# EasyEDA Pro project ax08.eprj, schematic ax08 main, sheets 5 to 13 of 16

## Sheets
5 memory interface: Page Name: memory interface
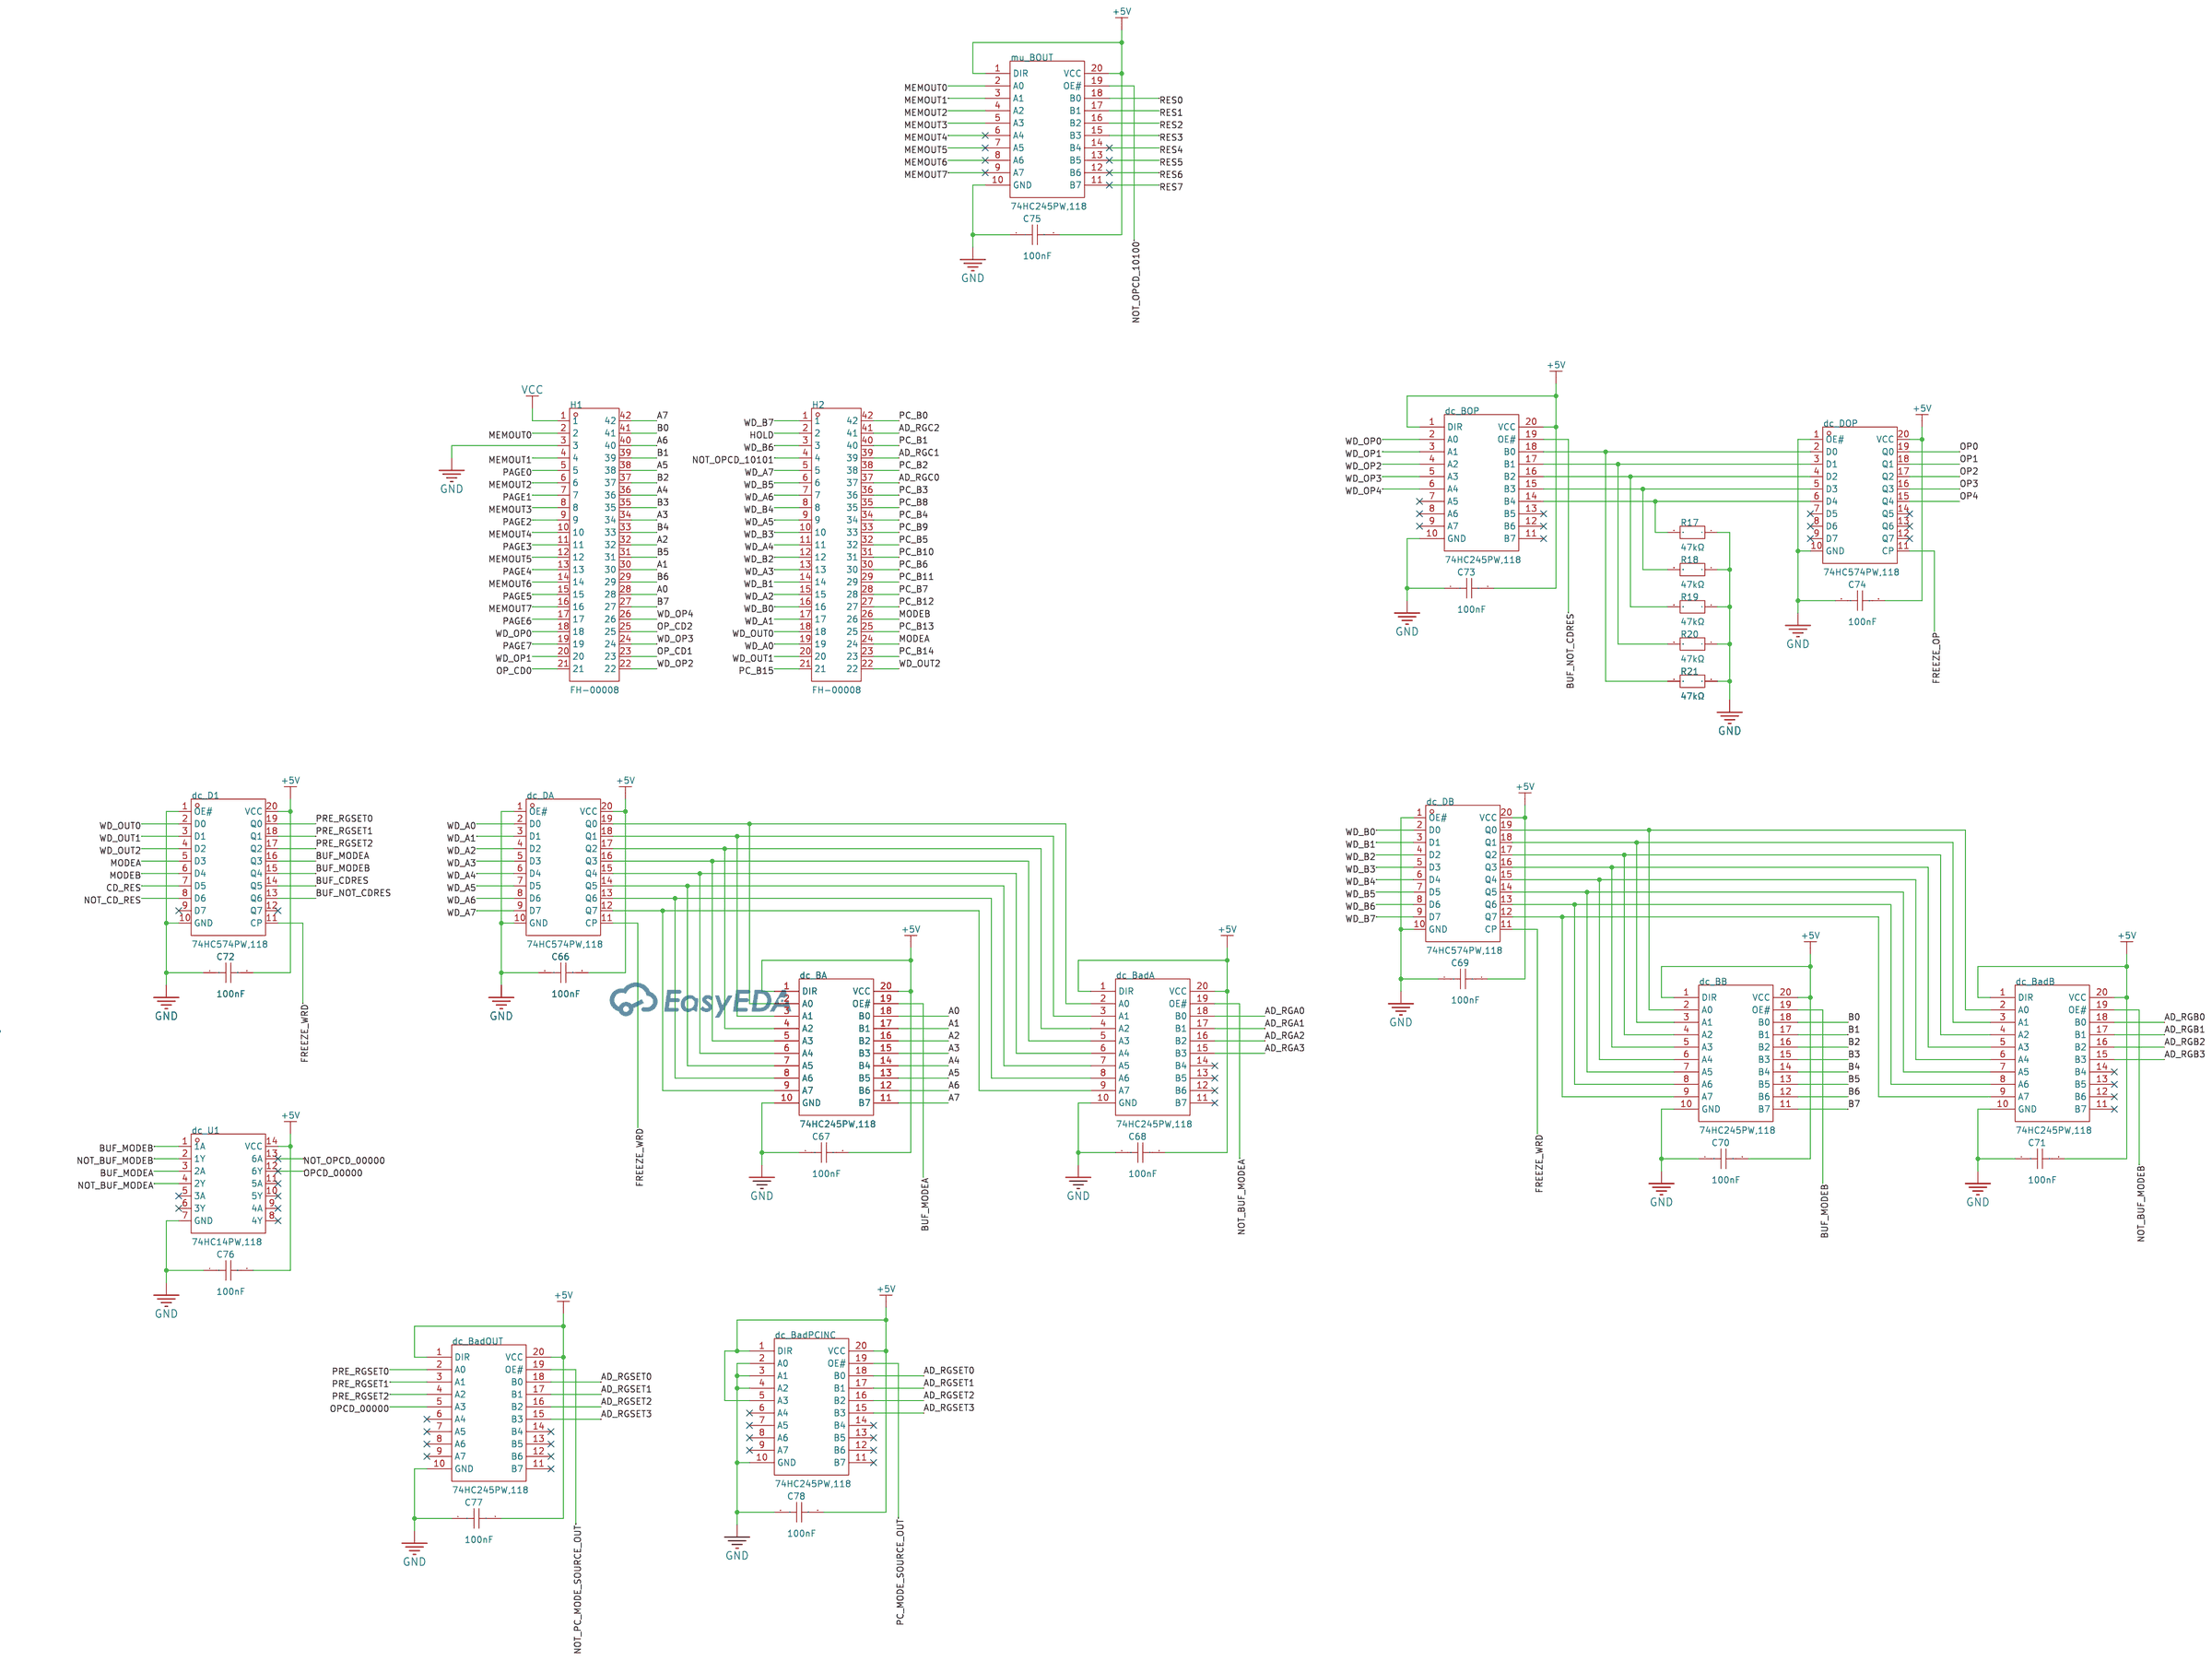
[diagram p26: memory interface]
6 hold unit: Board Name: ax08 1.0; Create Date: 2025-07-11; Page Name: hold unit; Schematic Name: ax08 1.0; Update Date: 2025-07-11
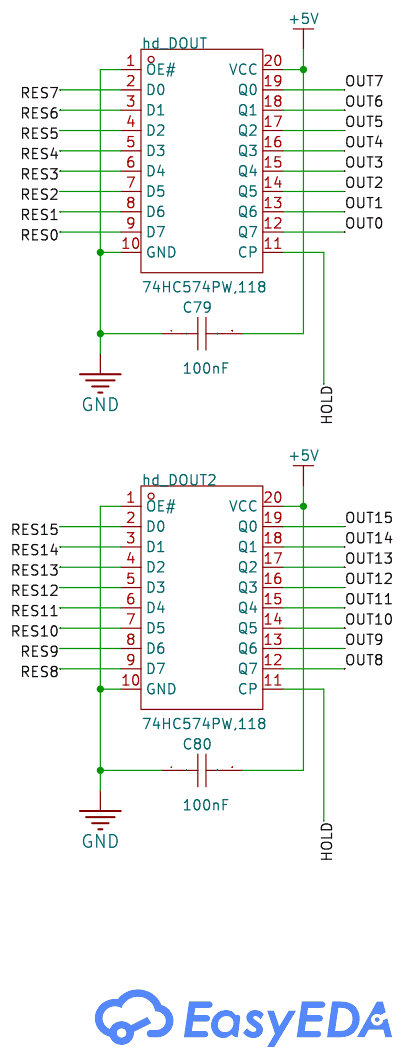
[diagram p27: hold unit]
7 frontpanel: Board Name: ax08 1.0; Create Date: 2025-07-11; Page Name: frontpanel; Schematic Name: ax08 1.0; Update Date: 2025-07-11
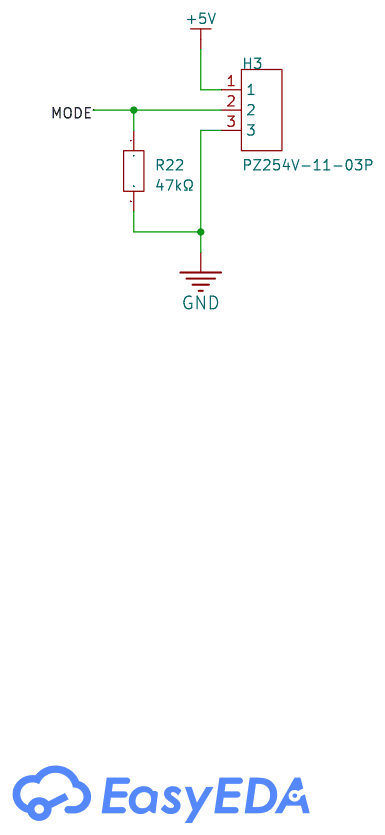
[diagram p28: frontpanel]
8 sequencer: Board Name: ax08 lite; Create Date: 2025-07-11; Page Name: sequencer; Schematic Name: ax08 lite; Update Date: 2025-07-11
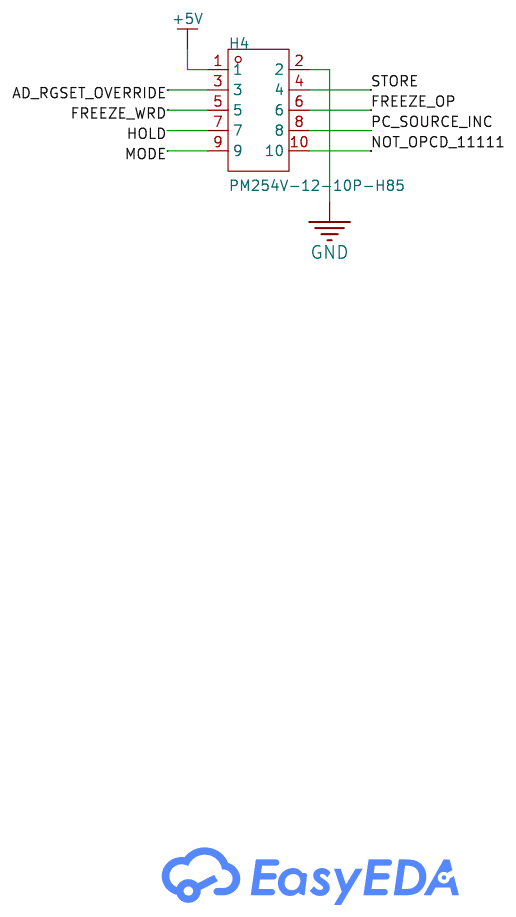
[diagram p29: sequencer]
9 opcode decoder: Page Name: opcode decoder; Update Date: 2025-09-12
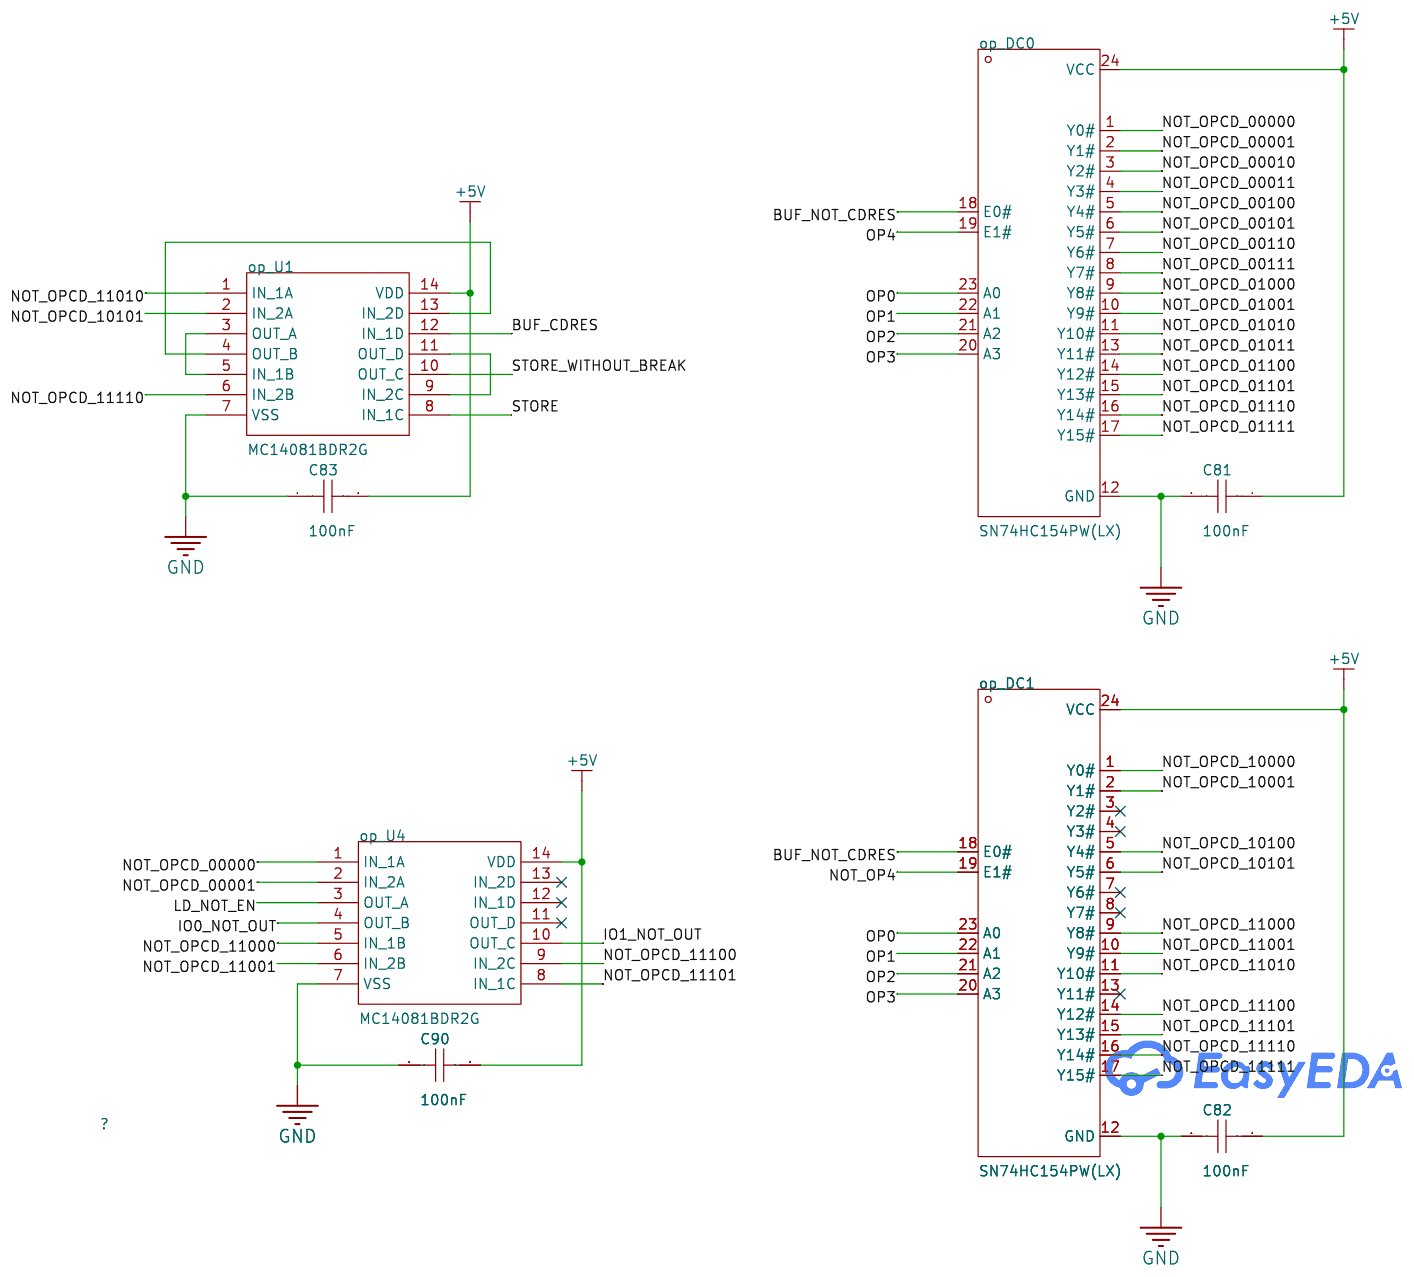
[diagram p30: opcode decoder]
10 IO units: Board Name: ax08 lite; Create Date: 2025-07-17; Page Name: IO units; Schematic Name: ax08 lite; Update Date: 2025-08-05
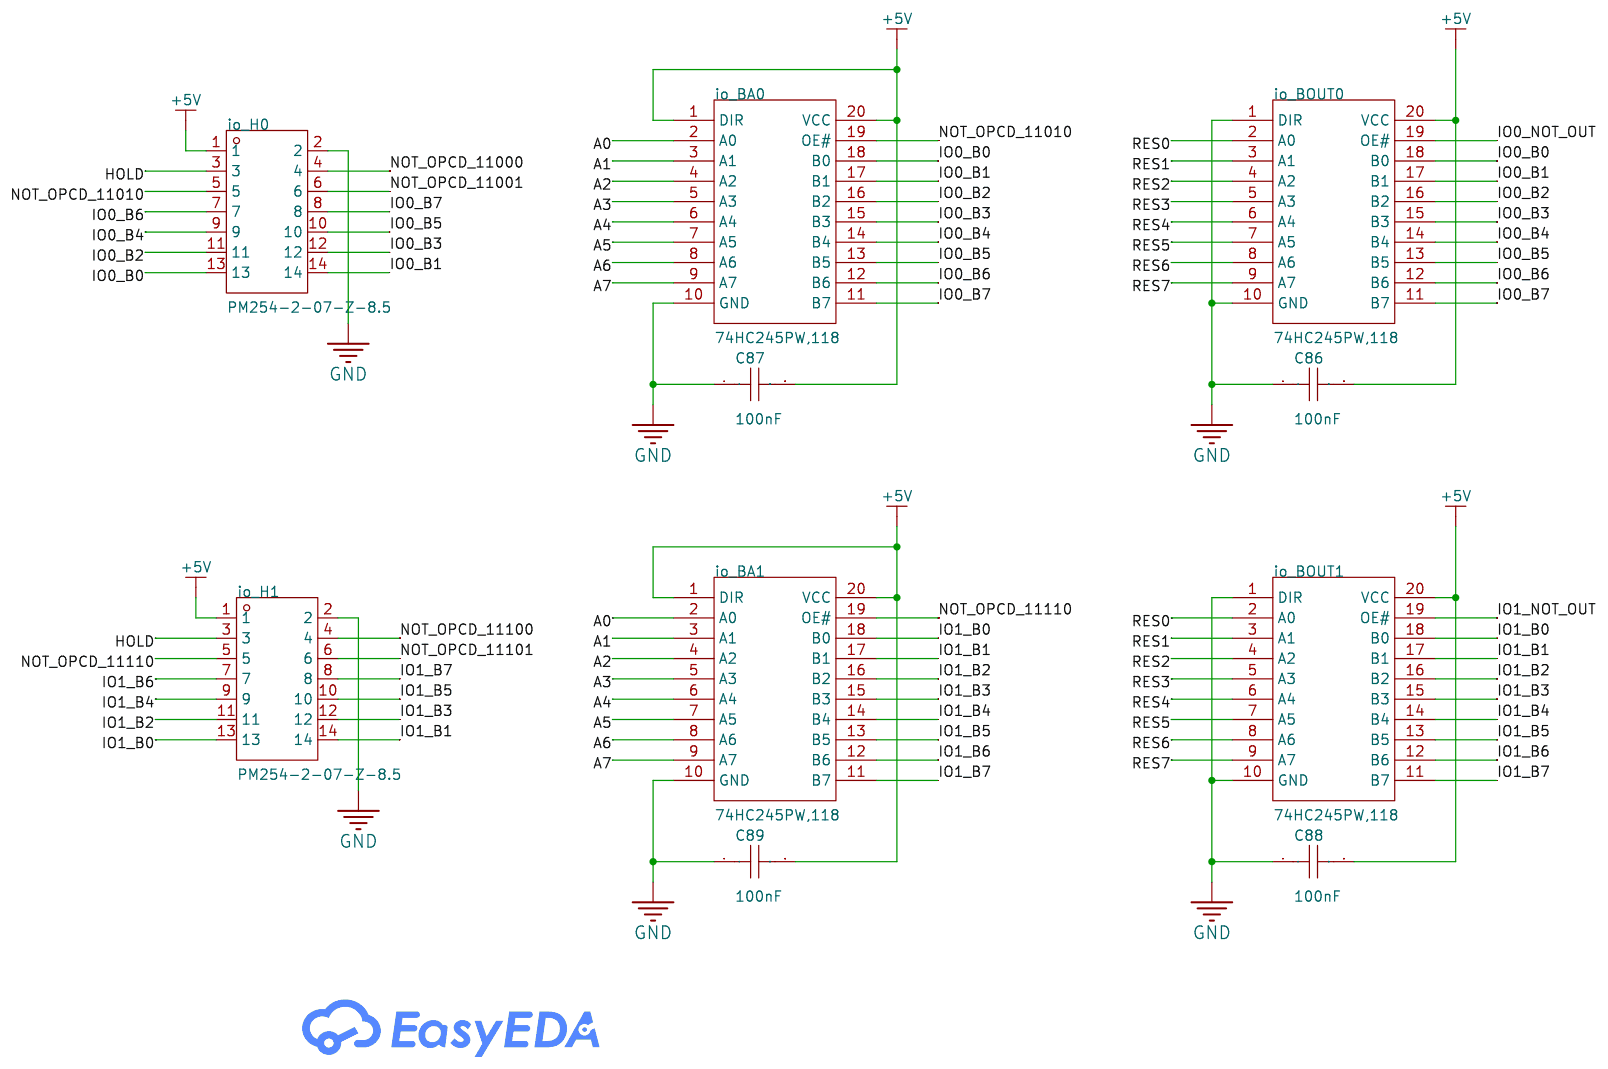
[diagram p31: IO units]
11 load unit: Board Name: ax08 lite; Create Date: 2025-07-18; Page Name: load unit; Schematic Name: ax08 lite; Update Date: 2025-07-18
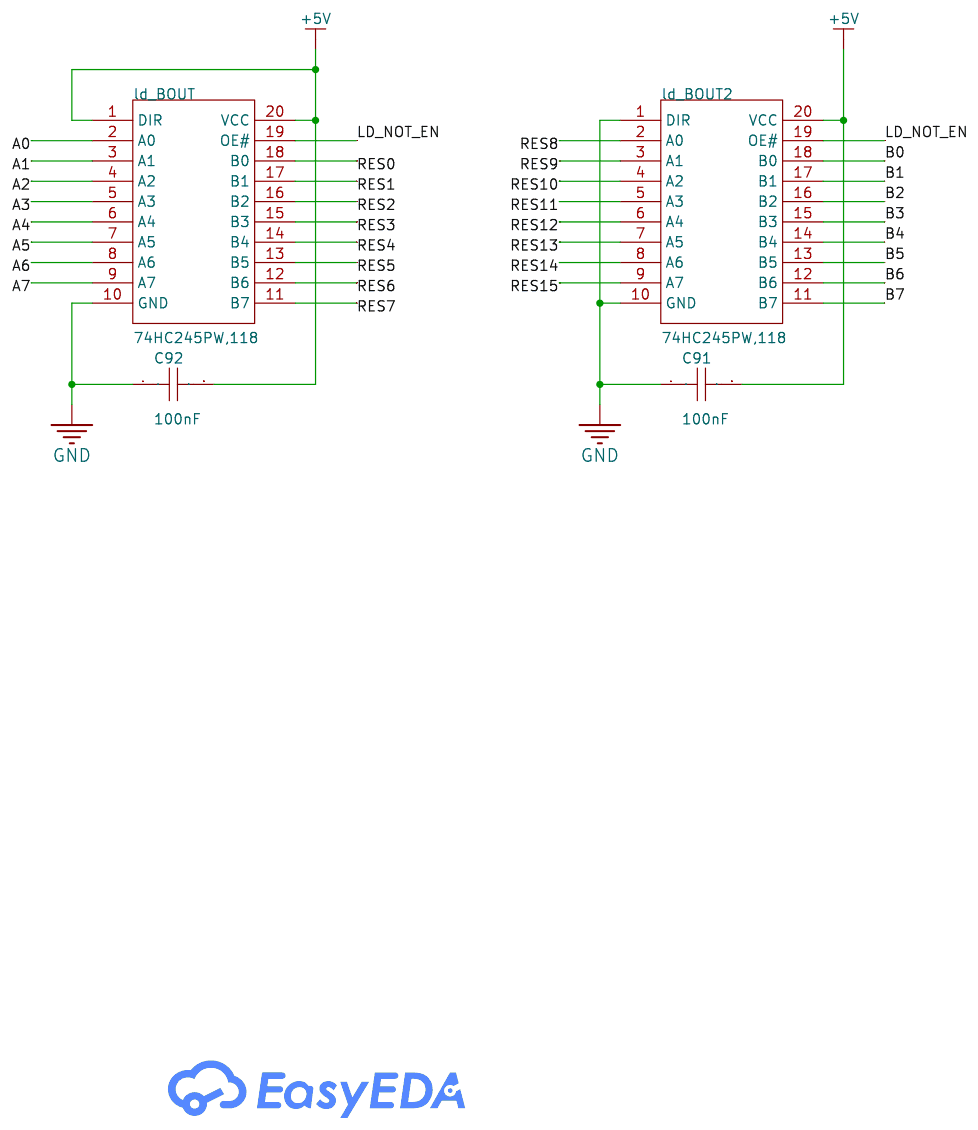
[diagram p32: load unit]
12 bitwise unit: Page Name: bitwise unit; Update Date: 2025-09-17
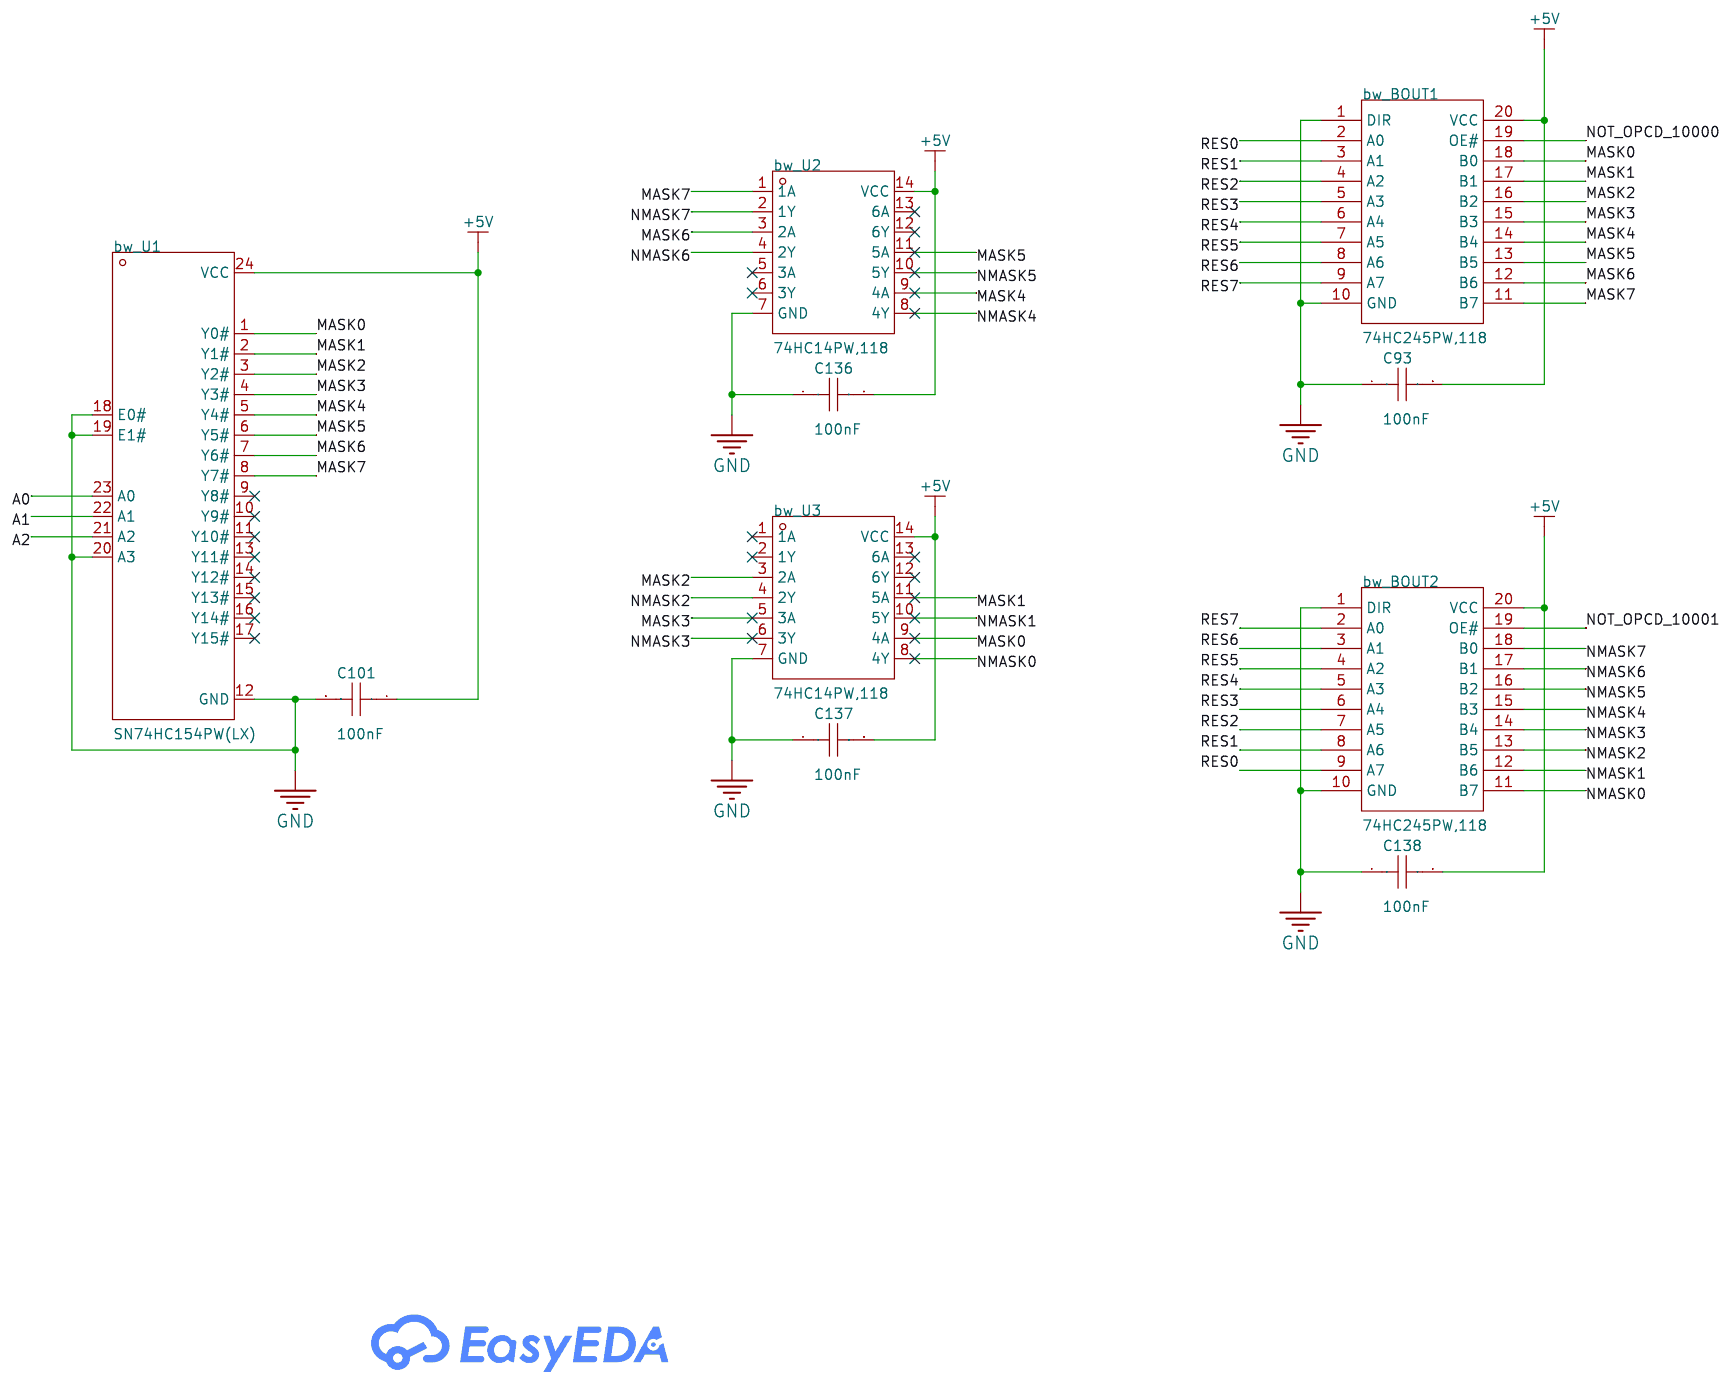
[diagram p33: bitwise unit]
13 logic unit: Page Name: logic unit; Update Date: 2025-09-15
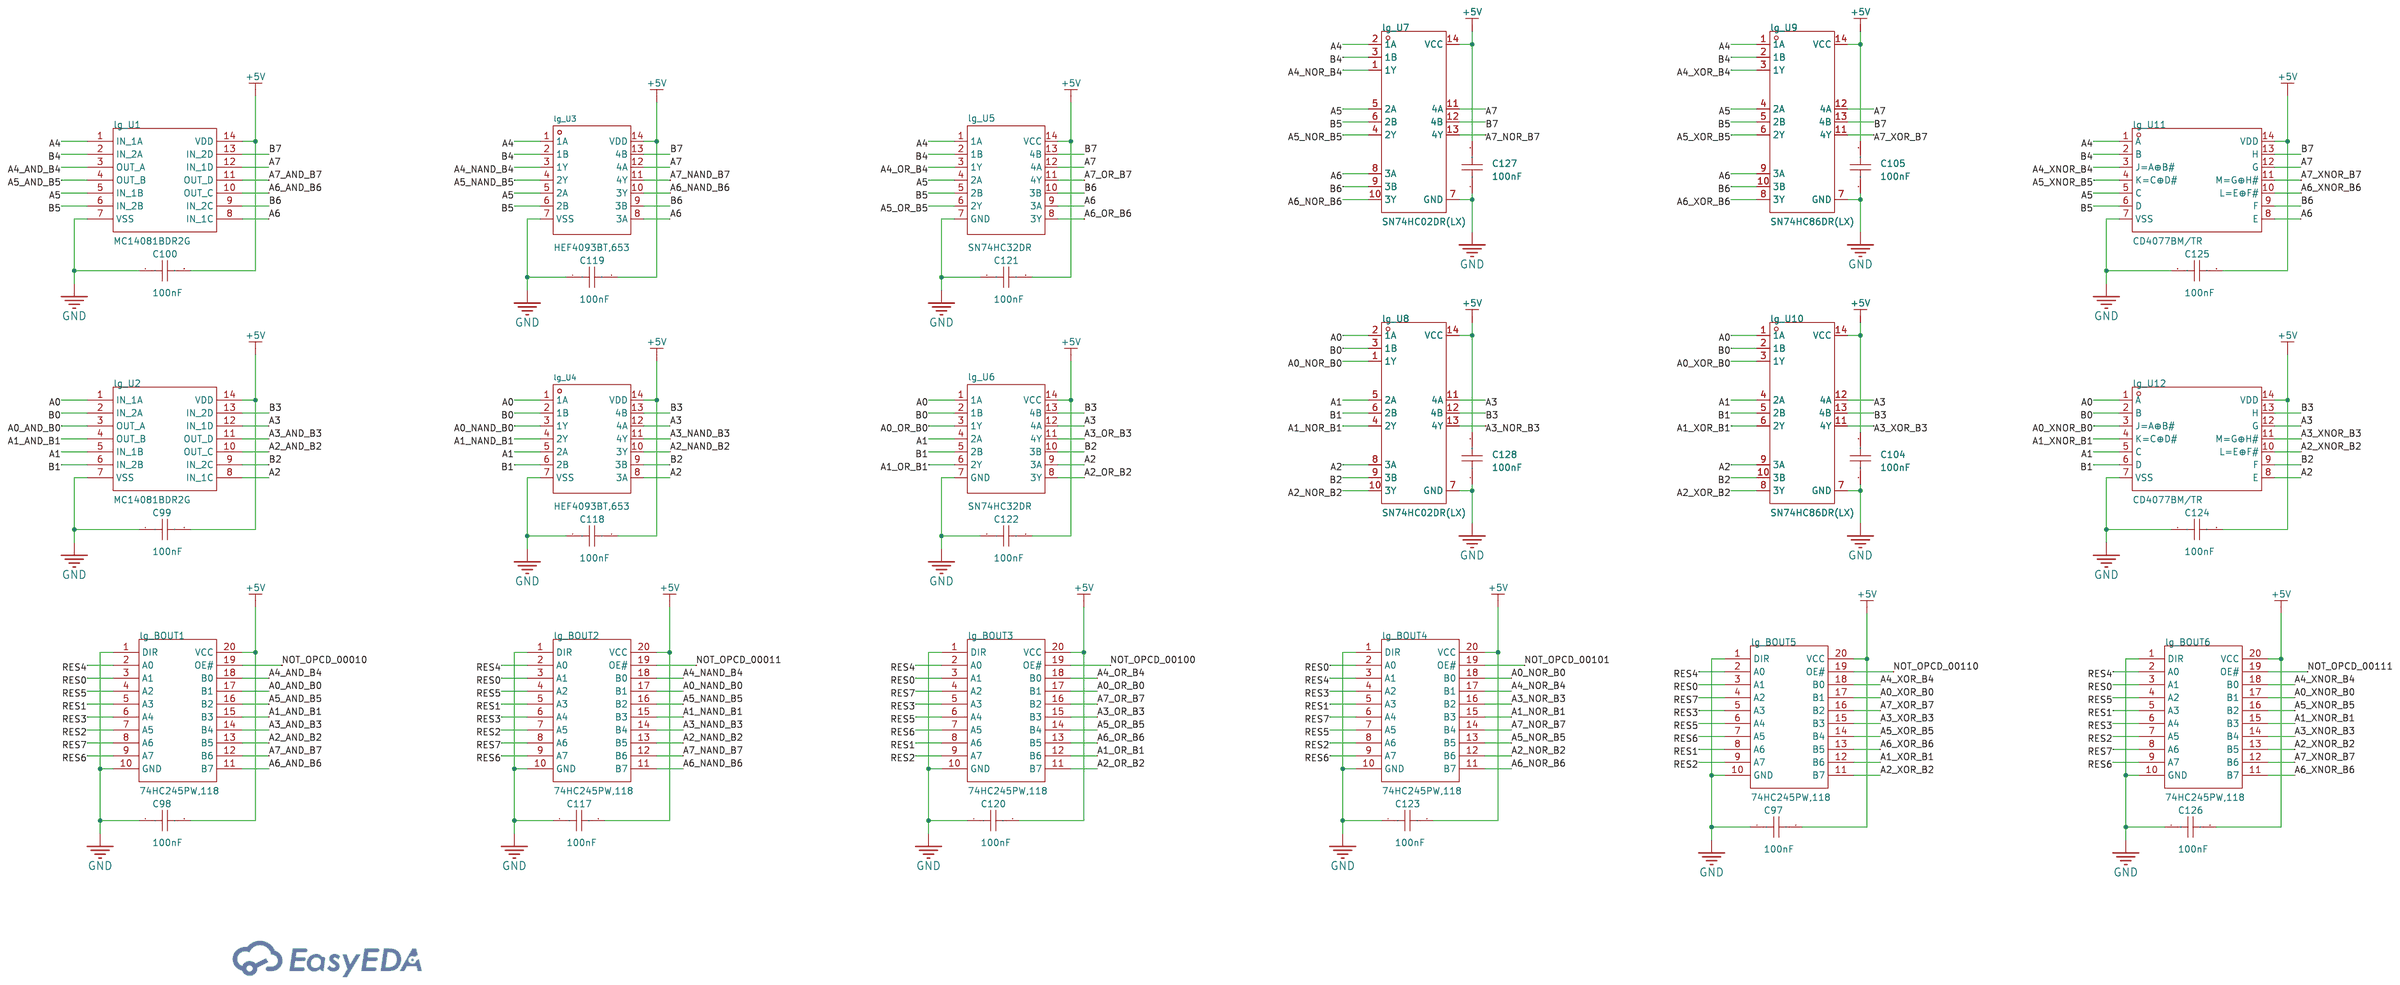
[diagram p34: logic unit]

## Parts
sheet bitwise unit
bw_BOUT1  74HC245PW,118  [TSSOP-20_L6.5-W4.4-P0.65-LS6.4-BL]
bw_BOUT2  74HC245PW,118  [TSSOP-20_L6.5-W4.4-P0.65-LS6.4-BL]
bw_U1  SN74HC154PW(LX)  [TSSOP-24_L7.8-W4.4-P0.65-LS6.4-BL_1]
bw_U2  74HC14PW,118  [TSSOP-14_L5.0-W4.4-P0.65-LS6.4-BL]
bw_U3  74HC14PW,118  [TSSOP-14_L5.0-W4.4-P0.65-LS6.4-BL]
C93  100nF  [C0805]
C101  100nF  [C0805]
C136  100nF  [C0805]
C137  100nF  [C0805]
C138  100nF  [C0805]
sheet frontpanel
H3  PZ254V-11-03P  [HDR-TH_3P-P2.54-V-M]
R22  47kΩ  [R0603]
sheet hold unit
C79  100nF  [C0805]
C80  100nF  [C0805]
hd_DOUT  74HC574PW,118  [TSSOP-20_L6.5-W4.4-P0.65-LS6.4-BL]
hd_DOUT2  74HC574PW,118  [TSSOP-20_L6.5-W4.4-P0.65-LS6.4-BL]
sheet IO units
C86  100nF  [C0805]
C87  100nF  [C0805]
C88  100nF  [C0805]
C89  100nF  [C0805]
io_BA0  74HC245PW,118  [TSSOP-20_L6.5-W4.4-P0.65-LS6.4-BL]
io_BA1  74HC245PW,118  [TSSOP-20_L6.5-W4.4-P0.65-LS6.4-BL]
io_BOUT0  74HC245PW,118  [TSSOP-20_L6.5-W4.4-P0.65-LS6.4-BL]
io_BOUT1  74HC245PW,118  [TSSOP-20_L6.5-W4.4-P0.65-LS6.4-BL]
io_H0  PM254-2-07-Z-8.5  [HDR-TH_14P-P2.54-V-F-R2-C7-S2.54]
io_H1  PM254-2-07-Z-8.5  [HDR-TH_14P-P2.54-V-F-R2-C7-S2.54]
sheet load unit
C91  100nF  [C0805]
C92  100nF  [C0805]
ld_BOUT  74HC245PW,118  [TSSOP-20_L6.5-W4.4-P0.65-LS6.4-BL]
ld_BOUT2  74HC245PW,118  [TSSOP-20_L6.5-W4.4-P0.65-LS6.4-BL]
sheet logic unit
C97  100nF  [C0805]
C98  100nF  [C0805]
C99  100nF  [C0805]
C100  100nF  [C0805]
C104  100nF  [C0805]
C105  100nF  [C0805]
C117  100nF  [C0805]
C118  100nF  [C0805]
C119  100nF  [C0805]
C120  100nF  [C0805]
C121  100nF  [C0805]
C122  100nF  [C0805]
C123  100nF  [C0805]
C124  100nF  [C0805]
C125  100nF  [C0805]
C126  100nF  [C0805]
C127  100nF  [C0805]
C128  100nF  [C0805]
lg_BOUT1  74HC245PW,118  [TSSOP-20_L6.5-W4.4-P0.65-LS6.4-BL]
lg_BOUT2  74HC245PW,118  [TSSOP-20_L6.5-W4.4-P0.65-LS6.4-BL]
lg_BOUT3  74HC245PW,118  [TSSOP-20_L6.5-W4.4-P0.65-LS6.4-BL]
lg_BOUT4  74HC245PW,118  [TSSOP-20_L6.5-W4.4-P0.65-LS6.4-BL]
lg_BOUT5  74HC245PW,118  [TSSOP-20_L6.5-W4.4-P0.65-LS6.4-BL]
lg_BOUT6  74HC245PW,118  [TSSOP-20_L6.5-W4.4-P0.65-LS6.4-BL]
lg_U1  MC14081BDR2G  [SOIC-14_L8.7-W3.9-P1.27-LS6.0-BL]
lg_U2  MC14081BDR2G  [SOIC-14_L8.7-W3.9-P1.27-LS6.0-BL]
lg_U3  HEF4093BT,653  [SOIC-14_L8.7-W3.9-P1.27-LS6.0-BL]
lg_U4  HEF4093BT,653  [SOIC-14_L8.7-W3.9-P1.27-LS6.0-BL]
lg_U5  SN74HC32DR  [SOIC-14_L8.7-W3.9-P1.27-LS6.0-BL]
lg_U6  SN74HC32DR  [SOIC-14_L8.7-W3.9-P1.27-LS6.0-BL]
lg_U7  SN74HC02DR(LX)  [SOP-14_L8.5-W3.8-P1.27-LS6.2-BL]
lg_U8  SN74HC02DR(LX)  [SOP-14_L8.5-W3.8-P1.27-LS6.2-BL]
lg_U9  SN74HC86DR(LX)  [SOP-14_L8.5-W3.8-P1.27-LS6.2-BL]
lg_U10  SN74HC86DR(LX)  [SOP-14_L8.5-W3.8-P1.27-LS6.2-BL]
lg_U11  CD4077BM/TR  [SOIC-14_L8.6-W3.9-P1.27-LS6.0-BL]
lg_U12  CD4077BM/TR  [SOIC-14_L8.6-W3.9-P1.27-LS6.0-BL]
sheet memory interface
C66  100nF  [C0805]
C67  100nF  [C0805]
C68  100nF  [C0805]
C69  100nF  [C0805]
C70  100nF  [C0805]
C71  100nF  [C0805]
C72  100nF  [C0805]
C73  100nF  [C0805]
C74  100nF  [C0805]
C75  100nF  [C0805]
C76  100nF  [C0805]
C77  100nF  [C0805]
C78  100nF  [C0805]
dc_BA  74HC245PW,118  [TSSOP-20_L6.5-W4.4-P0.65-LS6.4-BL]
dc_BadA  74HC245PW,118  [TSSOP-20_L6.5-W4.4-P0.65-LS6.4-BL]
dc_BadB  74HC245PW,118  [TSSOP-20_L6.5-W4.4-P0.65-LS6.4-BL]
dc_BadOUT  74HC245PW,118  [TSSOP-20_L6.5-W4.4-P0.65-LS6.4-BL]
dc_BadPCINC  74HC245PW,118  [TSSOP-20_L6.5-W4.4-P0.65-LS6.4-BL]
dc_BB  74HC245PW,118  [TSSOP-20_L6.5-W4.4-P0.65-LS6.4-BL]
dc_BOP  74HC245PW,118  [TSSOP-20_L6.5-W4.4-P0.65-LS6.4-BL]
dc_D1  74HC574PW,118  [TSSOP-20_L6.5-W4.4-P0.65-LS6.4-BL]
dc_DA  74HC574PW,118  [TSSOP-20_L6.5-W4.4-P0.65-LS6.4-BL]
dc_DB  74HC574PW,118  [TSSOP-20_L6.5-W4.4-P0.65-LS6.4-BL]
dc_DOP  74HC574PW,118  [TSSOP-20_L6.5-W4.4-P0.65-LS6.4-BL]
dc_U1  74HC14PW,118  [TSSOP-14_L5.0-W4.4-P0.65-LS6.4-BL]
H1  FH-00008  [HDR-TH_42P-P2.54-V-F-R2-C21-S2.54-1]
H2  FH-00008  [HDR-TH_42P-P2.54-V-F-R2-C21-S2.54-1]
mu_BOUT  74HC245PW,118  [TSSOP-20_L6.5-W4.4-P0.65-LS6.4-BL]
R17  47kΩ  [R0603]
R18  47kΩ  [R0603]
R19  47kΩ  [R0603]
R20  47kΩ  [R0603]
R21  47kΩ  [R0603]
sheet opcode decoder
C81  100nF  [C0805]
C82  100nF  [C0805]
C83  100nF  [C0805]
C90  100nF  [C0805]
op_DC0  SN74HC154PW(LX)  [TSSOP-24_L7.8-W4.4-P0.65-LS6.4-BL_1]
op_DC1  SN74HC154PW(LX)  [TSSOP-24_L7.8-W4.4-P0.65-LS6.4-BL_1]
op_U1  MC14081BDR2G  [SOIC-14_L8.7-W3.9-P1.27-LS6.0-BL]
op_U4  MC14081BDR2G  [SOIC-14_L8.7-W3.9-P1.27-LS6.0-BL]
sheet sequencer
H4  PM254V-12-10P-H85  [HDR-TH_10P-P2.54-V-F-R2-C5-S2.54]

## Library data of the parts
bw_BOUT1 bw_BOUT2 dc_BA dc_BadA dc_BadB dc_BadOUT dc_BadPCINC dc_BB dc_BOP io_BA0 io_BA1 io_BOUT0 io_BOUT1 ld_BOUT ld_BOUT2 lg_BOUT1-lg_BOUT6 mu_BOUT = 74HC245PW,118: Input type:- output type:Tri-State Supply Voltage:2V~6V Supply Voltage:2V~6V Number of Elements:1 Number of Bits per Element:8 Channel Type:- Sink Current:7.8mA Source Current:7.8mA Logic Family:74HC Operating Temperature:-40℃~+125℃ Operating Temperature:; Supplier Part: C5626; Manufacturer: Nexperia(安世); Supplier Footprint: TSSOP-20; JLCPCB Part Class: Extended Part; Datasheet: https://atta.szlcsc.com/upload/public/pdf/source/20240724/EDC8C45902BA97AEC59E8811E3964917.pdf; Supplier: LCSC; output type: Tri-State; Supply Voltage: 2V~6V; Number of Elements: 1; Number of Bits per Element: 8; Sink Current: 7.8mA; Source Current: 7.8mA; Logic Family: 74HC; Operating Temperature: -40℃~+125℃
bw_U1 op_DC0 op_DC1 = SN74HC154PW(LX): Type:Decoder/Demultiplexers Voltage Supply Source:Single supply Supply Voltage:2V~6V Supply Voltage:2V~6V Number of lines:4~16 Number of lines:4~16 Sink Current:- Source Current:- Operating temperature:-40℃~+125℃ Operating temperature:-40℃~+125℃; Supplier Part: C41413100; Manufacturer: LX(灵星芯微); Supplier Footprint: TSSOP-24; JLCPCB Part Class: Extended Part; Datasheet: https://atta.szlcsc.com/upload/public/pdf/source/20240923/0BF8EBFBC2EE7843BBF2E86797CF806E.pdf; Supplier: LCSC; Type: Decoder/Demultiplexers; Voltage Supply Source: Single supply; Supply Voltage: 2V~6V; Number of lines: 4~16; Operating temperature: -40℃~+125℃
bw_U2 bw_U3 dc_U1 = 74HC14PW,118: Input Type:Schmitt Trigger Supply Voltage(Single):2V~6V Supply Voltage(Single):2V~6V Supply Current (Max):2uA Number of Circuits:6 Number of Inputs:1 Sink Current:5.2mA Source Current:5.2mA High level range (VIH):1.5V~4.2V High level range (VIH):1.5V~4.2V; LCSC Part Name: 六路施密特触发反相器; Supplier Part: C5606; Manufacturer: Nexperia(安世); Supplier Footprint: TSSOP-14; JLCPCB Part Class: Extended Part; Datasheet: https://atta.szlcsc.com/upload/public/pdf/source/20170918/C131315_1505726904049976307.pdf; Supplier: LCSC; Input Type: Schmitt Trigger; Supply Voltage(Single): 2V~6V; Supply Current (Max): 2uA; Number of Circuits: 6; Number of Inputs: 1; Sink Current: 5.2mA; Source Current: 5.2mA; High level range (VIH): 1.5V~4.2V; Low level range (VIL): 300mV~1.2V; Max Propagation Delay: 21ns@6V,50pF; Series: 74HCSeries; Operating Temperature: -40℃~+125℃
C66-C83 C86-C93 C97-C101 C104 C105 C117-C128 C136-C138 = CC0805KRX7R9BB104: Capacitance: Tolerance:±10% Tolerance:±10% Voltage Rated: Temperature Coefficient:; LCSC Part Name: 100nF ±10% 50V; Supplier Part: C49678; Manufacturer: YAGEO(国巨); Supplier Footprint: 0805; JLCPCB Part Class: Basic Part; Datasheet: https://atta.szlcsc.com/upload/public/pdf/source/20180224/C181747_15194369449651363981.pdf; Supplier: LCSC; Tolerance: ±10%
H3 = PZ254V-11-03P: LCSC Part Name: 1x3P 间距:2.54mm 方针 直插; Supplier Part: C2937625; Manufacturer: XFCN(兴飞); Supplier Footprint: 插件,P=2.54mm; JLCPCB Part Class: Extended Part; Datasheet: https://atta.szlcsc.com/upload/public/pdf/source/20200309/C492402_8335C3D49C4E4C618838D59BB1D024C1.pdf; Supplier: LCSC; Pin Structure: 1x3P; Pitch: 2.54mm; Circluar Pins/Square Pins: Policy; Mounting Type: Straight; Number of Rows: Single Row; Number of Pins: 3P; Current Rating: 3A; Voltage Rating (Max): 250V; Length of Mating Pin: 6mm; Insulation Height: 2.5mm; Length of End Connection Pin: 3mm; Operating Temperature: -40℃~+105℃; Color: Black
R17-R22 = FRC0603F4702TS: LCSC Part Name: 47kΩ ±1% 100mW 厚膜电阻; Supplier Part: C2907042; Manufacturer: FOJAN(富捷); Supplier Footprint: 0603; JLCPCB Part Class: Extended Part; Datasheet: https://atta.szlcsc.com/upload/public/pdf/source/20211221/925EC7D7225764EE0046F22065062C87.pdf; Supplier: LCSC; Type: Thick Film Resistors; Tolerance: ±1%; Temperature Coefficient: ±100ppm/℃; Operating Temperature Range: -55℃~+155℃
dc_D1 dc_DA dc_DB dc_DOP hd_DOUT hd_DOUT2 = 74HC574PW,118: Type:D-Type Trigger Type:Rising Edge Supply Voltage:2V~6V Supply Voltage:2V~6V Clock Frequency:133MHz Function: Number of Elements:1 Number of Bits per Element:8 Output Type: Maximum Propagation Delay:26ns@6V,50pF Series:74HCSeries Sink Current:7.8mA Sour; Supplier Part: C93762; Manufacturer: Nexperia(安世); Supplier Footprint: TSSOP-20; JLCPCB Part Class: Extended Part; Datasheet: https://atta.szlcsc.com/upload/public/pdf/source/20230809/78F4E93A48B1813E6DF94573D4B43A3E.pdf; Supplier: LCSC; Type: D-Type; Trigger Type: Rising Edge; Supply Voltage: 2V~6V; Clock Frequency: 133MHz; Number of Elements: 1; Number of Bits per Element: 8; Maximum Propagation Delay: 26ns@6V,50pF; Series: 74HCSeries; Sink Current: 7.8mA; Source Current: 7.8mA; Quiescent Current (Iq): 8uA; Input Capacitance: 3.5pF; Operating Temperature: -40℃~+125℃
io_H0 io_H1 = PM254-2-07-Z-8.5: LCSC Part Name: 2x7P 间距:2.54mm 直插; Supplier Part: C2897408; Manufacturer: HCTL(华灿天禄); Supplier Footprint: 插件,P=2.54mm; JLCPCB Part Class: Extended Part; Datasheet: https://atta.szlcsc.com/upload/public/pdf/source/20230609/3D36CA2C1BFC9FD1C3F709AD9DFEB9C2.pdf; Supplier: LCSC; Holes Structure: 2x7P; Pitch: 2.54mm; Row Spacing: 2.54mm; Circular Hole / Square Hole: Square Holes; Mounting Type: Straight; Number of Rows: 双排; Number of Holes: 14P; Current Rating (Max): 3A; Holes Direction: Top; Insulation Height: 8.5mm; Contact Material: Copper Alloy; Operating Temperature Range: -40℃~+105℃; Soldering Temperature(Max): 260℃@5S
lg_U1 lg_U2 op_U1 op_U4 = MC14081BDR2G: Supplier Part: C52342; Manufacturer: onsemi(安森美); Supplier Footprint: SOIC-14; JLCPCB Part Class: Extended Part; Datasheet: https://atta.szlcsc.com/upload/public/pdf/source/20191203/C463300_6D19168778DBD465A86B239F140F6B23.pdf; Supplier: LCSC; Logic Gate Type: With Door; Number of Channels: 4; Supply Voltage: 3V~18V; Quiescent Current (Max): 1uA; Sink Current: 8.8mA; Source Current: 8.8mA; High Level Range (VIH): 3.5V~11V; Low Level Range (VIL): 1.5V~4V; Series: 4000BSeries; Propagation Delay Time: 100ns@15V,50pF; Operating Temperature: -55℃~+125℃
lg_U3 lg_U4 = HEF4093BT,653: Supplier Part: C7867; Manufacturer: Nexperia(安世); Supplier Footprint: SOIC-14; JLCPCB Part Class: Extended Part; Datasheet: https://item.szlcsc.com/datasheet/HEF4093BT%252C653/8344.html; Supplier: LCSC; Logic Type: NAND Gate; Number of Channels: 4; Voltage - Supply: 3V~15V; Quiescent Current: 1uA; Current - Output Low(IOL): 3.4mA; Current - Output High(IOH): 3.4mA; Input Logic Level - High: 3.5V~11V; Series: 4000B Series; Propagation Delay: 60ns@15V,50pF; Operating Temperature: -40℃~+125℃
lg_U5 lg_U6 = SN74HC32DR: Supplier Part: C6838; Manufacturer: TI(德州仪器); Supplier Footprint: SOIC-14; JLCPCB Part Class: Extended Part; Datasheet: https://www.ti.com/cn/lit/gpn/sn74hc32; Supplier: LCSC; Logic Type: OR Gate; Number of Channels: 4; Voltage - Supply: 2V~6V; Quiescent Current: 2uA; Current - Output Low(IOL): 5.2mA; Current - Output High(IOH): 5.2mA; Input Logic Level - High: 1.5V~4.2V; Input Logic Level - Low: 500mV~1.8V; Series: 74HCSeries; Propagation Delay: 17ns@6V,50pF; Operating Temperature: -40℃~+85℃
lg_U7 lg_U8 = SN74HC02DR(LX): LCSC Part Name: 集成电路; Supplier Part: C22436973; Manufacturer: LX(灵星芯微); Supplier Footprint: SOP-14; JLCPCB Part Class: Extended Part; Datasheet: https://atta.szlcsc.com/upload/public/pdf/source/20240524/51A1CFFE34F7E3393CC9DF2233B8CA37.pdf; Supplier: LCSC; Logic Type: NOR Gate; Number of Channels: 4; Voltage - Supply: 2V~6V; Quiescent Current: 2uA; Input Logic Level - High: 1.5V~4.2V; Input Logic Level - Low: 500mV~1.8V; Series: 74HCSeries; Propagation Delay: 15ns@6V,50pF; Operating Temperature: -40℃~+105℃
lg_U9 lg_U10 = SN74HC86DR(LX): LCSC Part Name: 集成电路; Supplier Part: C22436997; Manufacturer: LX(灵星芯微); Supplier Footprint: SOP-14; JLCPCB Part Class: Extended Part; Datasheet: https://atta.szlcsc.com/upload/public/pdf/source/20240524/675B1C928075FFB7AC00BEC82378813F.pdf; Supplier: LCSC; Logic Gate Type: XORGate; Number of Channels: 4; Supply Voltage: 2V~6V; Quiescent Current (Max): 2uA; High Level Range (VIH): 1.5V~4.2V; Low Level Range (VIL): 500mV~1.8V; Series: 74HCSeries; Propagation Delay Time: 20ns@6V,50pF; Operating Temperature: -40℃~+125℃
lg_U11 lg_U12 = CD4077BM/TR: LCSC Part Name: 四路2输入异或非门; Supplier Part: C7432111; Manufacturer: HGSEMI(华冠); Supplier Footprint: SOP-14; JLCPCB Part Class: Extended Part; Datasheet: https://item.szlcsc.com/datasheet/CD4077BM%252FTR/8436551.html; Supplier: LCSC; Logic Type: XNOR Gate; Number of Channels: 4; Series: 4000 Series; Operating Temperature: -40℃~+85℃
H1 H2 = FH-00008: LCSC Part Name: 间距:2.54mm 2x21P 直插; Supplier Part: C2829909; Manufacturer: Liansheng(连盛); Supplier Footprint: 插件,P=2.54mm; JLCPCB Part Class: Extended Part; Datasheet: https://atta.szlcsc.com/upload/public/pdf/source/20210507/C2829909_E013D232F5A3E6CEA712FF456C43D3BD.pdf; Supplier: LCSC; Holes Structure: 2x21P; Pitch: 2.54mm; Row Spacing: 2.54mm; Circular Hole / Square Hole: Square Hole; Mounting Type: Direct Insert; Number of Rows: Double Row; Number of Positions: 42P; Current Rating: 3A; Holes Direction: Top; Insulation Height: 8.5mm; Contact Material: Brass; Contact Plating: Gold; Operating Temperature: -40℃~+105℃
H4 = PM254V-12-10P-H85: LCSC Part Name: 间距:2.54mm 2x5P 直插; Supplier Part: C492399; Manufacturer: XFCN(兴飞); Supplier Footprint: 插件,P=2.54mm; JLCPCB Part Class: Extended Part; Datasheet: https://atta.szlcsc.com/upload/public/pdf/source/20200309/C492399_8C441E2934FBB604A89B37A68AA45ECF.pdf; Supplier: LCSC; Holes Structure: 2x5P; Pitch: 2.54mm; Row Spacing: 2.54mm; Mounting Type: Straight; Number of Rows: 双排; Number of Holes: 10P; Contact Material: Brass

## Nets
+5V: bw_BOUT1.20(VCC) bw_BOUT2.20(VCC) bw_U1.24(VCC) bw_U2.14(VCC) bw_U3.14(VCC) C66.2 C67.2 C68.2 C69.2 C70.2 C71.2 C72.2 C73.2 C74.2 C75.2 C76.2 C77.2 C78.2 C79.2 C80.2 C81.1 C82.1 C83.2 C86.2 C87.2 C88.2 C89.2 C90.2 C91.2 C92.2 C93.2 C97.2 C98.2 C99.2 C100.2 C101.1 C104.2 C105.2 C117.2 C118.2 C119.2 C120.2 C121.2 C122.2 C123.2 C124.2 C125.2 C126.2 C127.2 C128.2 C136.2 C137.2 C138.2 dc_BA.1(DIR) dc_BA.20(VCC) dc_BadA.1(DIR) dc_BadA.20(VCC) dc_BadB.1(DIR) dc_BadB.20(VCC) dc_BadOUT.1(DIR) dc_BadOUT.20(VCC) dc_BadPCINC.1(DIR) dc_BadPCINC.5(A3) dc_BadPCINC.20(VCC) dc_BB.1(DIR) dc_BB.20(VCC) dc_BOP.1(DIR) dc_BOP.20(VCC) dc_D1.20(VCC) dc_DA.20(VCC) dc_DB.20(VCC) dc_DOP.20(VCC) dc_U1.14(VCC) H3.1 H4.1 hd_DOUT.20(VCC) hd_DOUT2.20(VCC) io_BA0.1(DIR) io_BA0.20(VCC) io_BA1.1(DIR) io_BA1.20(VCC) io_BOUT0.20(VCC) io_BOUT1.20(VCC) io_H0.1 io_H1.1 ld_BOUT.1(DIR) ld_BOUT.20(VCC) ld_BOUT2.20(VCC) lg_BOUT1.20(VCC) lg_BOUT2.20(VCC) lg_BOUT3.20(VCC) lg_BOUT4.20(VCC) lg_BOUT5.20(VCC) lg_BOUT6.20(VCC) lg_U1.14(VDD) lg_U2.14(VDD) lg_U3.14(VDD) lg_U4.14(VDD) lg_U5.14(VCC) lg_U6.14(VCC) lg_U7.14(VCC) lg_U8.14(VCC) lg_U9.14(VCC) lg_U10.14(VCC) lg_U11.14(VDD) lg_U12.14(VDD) mu_BOUT.1(DIR) mu_BOUT.20(VCC) op_DC0.24(VCC) op_DC1.24(VCC) op_U1.14(VDD) op_U4.14(VDD) ; also on sheet 1 2 3 4 14 15 16
GND: bw_BOUT1.1(DIR) bw_BOUT1.10(GND) bw_BOUT2.1(DIR) bw_BOUT2.10(GND) bw_U1.12(GND) bw_U1.18(E0#) bw_U1.19(E1#) bw_U1.20(A3) bw_U2.7(GND) bw_U3.7(GND) C66.1 C67.1 C68.1 C69.1 C70.1 C71.1 C72.1 C73.1 C74.1 C75.1 C76.1 C77.1 C78.1 C79.1 C80.1 C81.2 C82.2 C83.1 C86.1 C87.1 C88.1 C89.1 C90.1 C91.1 C92.1 C93.1 C97.1 C98.1 C99.1 C100.1 C101.2 C104.1 C105.1 C117.1 C118.1 C119.1 C120.1 C121.1 C122.1 C123.1 C124.1 C125.1 C126.1 C127.1 C128.1 C136.1 C137.1 C138.1 dc_BA.10(GND) dc_BadA.10(GND) dc_BadB.10(GND) dc_BadOUT.10(GND) dc_BadPCINC.2(A0) dc_BadPCINC.3(A1) dc_BadPCINC.4(A2) dc_BadPCINC.10(GND) dc_BB.10(GND) dc_BOP.10(GND) dc_D1.1(OE#) dc_D1.10(GND) dc_DA.1(OE#) dc_DA.10(GND) dc_DB.1(OE#) dc_DB.10(GND) dc_DOP.1(OE#) dc_DOP.10(GND) dc_U1.7(GND) H1.3 H3.3 H4.2 hd_DOUT.1(OE#) hd_DOUT.10(GND) hd_DOUT2.1(OE#) hd_DOUT2.10(GND) io_BA0.10(GND) io_BA1.10(GND) io_BOUT0.1(DIR) io_BOUT0.10(GND) io_BOUT1.1(DIR) io_BOUT1.10(GND) io_H0.2 io_H1.2 ld_BOUT.10(GND) ld_BOUT2.1(DIR) ld_BOUT2.10(GND) lg_BOUT1.1(DIR) lg_BOUT1.10(GND) lg_BOUT2.1(DIR) lg_BOUT2.10(GND) lg_BOUT3.1(DIR) lg_BOUT3.10(GND) lg_BOUT4.1(DIR) lg_BOUT4.10(GND) lg_BOUT5.1(DIR) lg_BOUT5.10(GND) lg_BOUT6.1(DIR) lg_BOUT6.10(GND) lg_U1.7(VSS) lg_U2.7(VSS) lg_U3.7(VSS) lg_U4.7(VSS) lg_U5.7(GND) lg_U6.7(GND) lg_U7.7(GND) lg_U8.7(GND) lg_U9.7(GND) lg_U10.7(GND) lg_U11.7(VSS) lg_U12.7(VSS) mu_BOUT.10(GND) op_DC0.12(GND) op_DC1.12(GND) op_U1.7(VSS) op_U4.7(VSS) R17.1 R18.1 R19.1 R20.1 R21.1 R22.2 ; also on sheet 1 2 3 4 14 15 16
VCC: H1.1 ; also on sheet 15
A0: bw_U1.23(A0) dc_BA.18(B0) H1.28 io_BA0.2(A0) io_BA1.2(A0) ld_BOUT.2(A0) lg_U2.1(IN 1A) lg_U4.1(1A) lg_U6.1(1A) lg_U8.2(1A) lg_U10.1(1A) lg_U12.1(A) ; also on sheet 1 2 4 14
A0_AND_B0: lg_BOUT1.17(B1) lg_U2.3(OUT A)
A0_NAND_B0: lg_BOUT2.17(B1) lg_U4.3(1Y)
A0_NOR_B0: lg_BOUT4.18(B0) lg_U8.1(1Y)
A0_OR_B0: lg_BOUT3.17(B1) lg_U6.3(1Y)
A0_XNOR_B0: lg_BOUT6.17(B1) lg_U12.3(J=A⊕B#)
A0_XOR_B0: lg_BOUT5.17(B1) lg_U10.3(1Y)
A1: bw_U1.22(A1) dc_BA.17(B1) H1.30 io_BA0.3(A1) io_BA1.3(A1) ld_BOUT.3(A1) lg_U2.5(IN 1B) lg_U4.5(2A) lg_U6.4(2A) lg_U8.5(2A) lg_U10.4(2A) lg_U12.5(C) ; also on sheet 1 2 4 14
A1_AND_B1: lg_BOUT1.15(B3) lg_U2.4(OUT B)
A1_NAND_B1: lg_BOUT2.15(B3) lg_U4.4(2Y)
A1_NOR_B1: lg_BOUT4.15(B3) lg_U8.4(2Y)
A1_OR_B1: lg_BOUT3.12(B6) lg_U6.6(2Y)
A1_XNOR_B1: lg_BOUT6.15(B3) lg_U12.4(K=C⊕D#)
A1_XOR_B1: lg_BOUT5.12(B6) lg_U10.6(2Y)
A2: bw_U1.21(A2) dc_BA.16(B2) H1.32 io_BA0.4(A2) io_BA1.4(A2) ld_BOUT.4(A2) lg_U2.8(IN 1C) lg_U4.8(3A) lg_U6.9(3A) lg_U8.8(3A) lg_U10.9(3A) lg_U12.8(E) ; also on sheet 1 2 4 14
A2_AND_B2: lg_BOUT1.13(B5) lg_U2.10(OUT C)
A2_NAND_B2: lg_BOUT2.13(B5) lg_U4.10(3Y)
A2_NOR_B2: lg_BOUT4.12(B6) lg_U8.10(3Y)
A2_OR_B2: lg_BOUT3.11(B7) lg_U6.8(3Y)
A2_XNOR_B2: lg_BOUT6.13(B5) lg_U12.10(L=E⊕F#)
A2_XOR_B2: lg_BOUT5.11(B7) lg_U10.8(3Y)
A3: dc_BA.15(B3) H1.34 io_BA0.5(A3) io_BA1.5(A3) ld_BOUT.5(A3) lg_U2.12(IN 1D) lg_U4.12(4A) lg_U6.12(4A) lg_U8.11(4A) lg_U10.12(4A) lg_U12.12(G) ; also on sheet 1 2 4 14
A3_AND_B3: lg_BOUT1.14(B4) lg_U2.11(OUT D)
A3_NAND_B3: lg_BOUT2.14(B4) lg_U4.11(4Y)
A3_NOR_B3: lg_BOUT4.16(B2) lg_U8.13(4Y)
A3_OR_B3: lg_BOUT3.15(B3) lg_U6.11(4Y)
A3_XNOR_B3: lg_BOUT6.14(B4) lg_U12.11(M=G⊕H#)
A3_XOR_B3: lg_BOUT5.15(B3) lg_U10.11(4Y)
A4: dc_BA.14(B4) H1.36 io_BA0.6(A4) io_BA1.6(A4) ld_BOUT.6(A4) lg_U1.1(IN 1A) lg_U3.1(1A) lg_U5.1(1A) lg_U7.2(1A) lg_U9.1(1A) lg_U11.1(A) ; also on sheet 1 2 4 14
A4_AND_B4: lg_BOUT1.18(B0) lg_U1.3(OUT A)
A4_NAND_B4: lg_BOUT2.18(B0) lg_U3.3(1Y)
A4_NOR_B4: lg_BOUT4.17(B1) lg_U7.1(1Y)
A4_OR_B4: lg_BOUT3.18(B0) lg_U5.3(1Y)
A4_XNOR_B4: lg_BOUT6.18(B0) lg_U11.3(J=A⊕B#)
A4_XOR_B4: lg_BOUT5.18(B0) lg_U9.3(1Y)
A5: dc_BA.13(B5) H1.38 io_BA0.7(A5) io_BA1.7(A5) ld_BOUT.7(A5) lg_U1.5(IN 1B) lg_U3.5(2A) lg_U5.4(2A) lg_U7.5(2A) lg_U9.4(2A) lg_U11.5(C) ; also on sheet 1 2 4 14
A5_AND_B5: lg_BOUT1.16(B2) lg_U1.4(OUT B)
A5_NAND_B5: lg_BOUT2.16(B2) lg_U3.4(2Y)
A5_NOR_B5: lg_BOUT4.13(B5) lg_U7.4(2Y)
A5_OR_B5: lg_BOUT3.14(B4) lg_U5.6(2Y)
A5_XNOR_B5: lg_BOUT6.16(B2) lg_U11.4(K=C⊕D#)
A5_XOR_B5: lg_BOUT5.14(B4) lg_U9.6(2Y)
A6: dc_BA.12(B6) H1.40 io_BA0.8(A6) io_BA1.8(A6) ld_BOUT.8(A6) lg_U1.8(IN 1C) lg_U3.8(3A) lg_U5.9(3A) lg_U7.8(3A) lg_U9.9(3A) lg_U11.8(E) ; also on sheet 1 2 4 14
A6_AND_B6: lg_BOUT1.11(B7) lg_U1.10(OUT C)
A6_NAND_B6: lg_BOUT2.11(B7) lg_U3.10(3Y)
A6_NOR_B6: lg_BOUT4.11(B7) lg_U7.10(3Y)
A6_OR_B6: lg_BOUT3.13(B5) lg_U5.8(3Y)
A6_XNOR_B6: lg_BOUT6.11(B7) lg_U11.10(L=E⊕F#)
A6_XOR_B6: lg_BOUT5.13(B5) lg_U9.8(3Y)
A7: dc_BA.11(B7) H1.42 io_BA0.9(A7) io_BA1.9(A7) ld_BOUT.9(A7) lg_U1.12(IN 1D) lg_U3.12(4A) lg_U5.12(4A) lg_U7.11(4A) lg_U9.12(4A) lg_U11.12(G) ; also on sheet 1 2 4 14
A7_AND_B7: lg_BOUT1.12(B6) lg_U1.11(OUT D)
A7_NAND_B7: lg_BOUT2.12(B6) lg_U3.11(4Y)
A7_NOR_B7: lg_BOUT4.14(B4) lg_U7.13(4Y)
A7_OR_B7: lg_BOUT3.16(B2) lg_U5.11(4Y)
A7_XNOR_B7: lg_BOUT6.12(B6) lg_U11.11(M=G⊕H#)
A7_XOR_B7: lg_BOUT5.16(B2) lg_U9.11(4Y)
AD_RGA0: dc_BadA.18(B0) ; also on sheet 1
AD_RGA1: dc_BadA.17(B1) ; also on sheet 1
AD_RGA2: dc_BadA.16(B2) ; also on sheet 1
AD_RGA3: dc_BadA.15(B3) ; also on sheet 1
AD_RGB0: dc_BadB.18(B0) ; also on sheet 1
AD_RGB1: dc_BadB.17(B1) ; also on sheet 1
AD_RGB2: dc_BadB.16(B2) ; also on sheet 1
AD_RGB3: dc_BadB.15(B3) ; also on sheet 1
AD_RGC0: H2.37 ; also on sheet 1
AD_RGC1: H2.39 ; also on sheet 1
AD_RGC2: H2.41 ; also on sheet 1
AD_RGSET0: dc_BadOUT.18(B0) dc_BadPCINC.18(B0) ; also on sheet 1
AD_RGSET1: dc_BadOUT.17(B1) dc_BadPCINC.17(B1) ; also on sheet 1
AD_RGSET2: dc_BadOUT.16(B2) dc_BadPCINC.16(B2) ; also on sheet 1
AD_RGSET3: dc_BadOUT.15(B3) dc_BadPCINC.15(B3) ; also on sheet 1
AD_RGSET_OVERRIDE: H4.3 ; also on sheet 3 16
B0: dc_BB.18(B0) H1.41 ld_BOUT2.18(B0) lg_U2.2(IN 2A) lg_U4.2(1B) lg_U6.2(1B) lg_U8.3(1B) lg_U10.2(1B) lg_U12.2(B) ; also on sheet 1 2 4 14
B1: dc_BB.17(B1) H1.39 ld_BOUT2.17(B1) lg_U2.6(IN 2B) lg_U4.6(2B) lg_U6.5(2B) lg_U8.6(2B) lg_U10.5(2B) lg_U12.6(D) ; also on sheet 1 2 4 14
B2: dc_BB.16(B2) H1.37 ld_BOUT2.16(B2) lg_U2.9(IN 2C) lg_U4.9(3B) lg_U6.10(3B) lg_U8.9(3B) lg_U10.10(3B) lg_U12.9(F) ; also on sheet 1 2 4 14
B3: dc_BB.15(B3) H1.35 ld_BOUT2.15(B3) lg_U2.13(IN 2D) lg_U4.13(4B) lg_U6.13(4B) lg_U8.12(4B) lg_U10.13(4B) lg_U12.13(H) ; also on sheet 1 2 4 14
B4: dc_BB.14(B4) H1.33 ld_BOUT2.14(B4) lg_U1.2(IN 2A) lg_U3.2(1B) lg_U5.2(1B) lg_U7.3(1B) lg_U9.2(1B) lg_U11.2(B) ; also on sheet 1 2 4 14
B5: dc_BB.13(B5) H1.31 ld_BOUT2.13(B5) lg_U1.6(IN 2B) lg_U3.6(2B) lg_U5.5(2B) lg_U7.6(2B) lg_U9.5(2B) lg_U11.6(D) ; also on sheet 1 2 4 14
B6: dc_BB.12(B6) H1.29 ld_BOUT2.12(B6) lg_U1.9(IN 2C) lg_U3.9(3B) lg_U5.10(3B) lg_U7.9(3B) lg_U9.10(3B) lg_U11.9(F) ; also on sheet 1 2 4 14
B7: dc_BB.11(B7) H1.27 ld_BOUT2.11(B7) lg_U1.13(IN 2D) lg_U3.13(4B) lg_U5.13(4B) lg_U7.12(4B) lg_U9.13(4B) lg_U11.13(H) ; also on sheet 1 2 4 14
BUF_CDRES: dc_D1.14(Q5) op_U1.12(IN 1D)
BUF_MODEA: dc_BA.19(OE#) dc_D1.16(Q3) dc_U1.3(2A) ; also on sheet 1
BUF_MODEB: dc_BB.19(OE#) dc_D1.15(Q4) dc_U1.1(1A) ; also on sheet 1
BUF_NOT_CDRES: dc_BOP.19(OE#) dc_D1.13(Q6) op_DC0.18(E0#) op_DC1.18(E0#)
CD_RES: dc_D1.7(D5) ; also on sheet 3
FREEZE_OP: dc_DOP.11(CP) H4.6 ; also on sheet 16
FREEZE_WRD: dc_D1.11(CP) dc_DA.11(CP) dc_DB.11(CP) H4.5 ; also on sheet 2 16
HOLD: H2.2 H4.7 hd_DOUT.11(CP) hd_DOUT2.11(CP) io_H0.3 io_H1.3 ; also on sheet 14 16
IO0_B0: io_BA0.18(B0) io_BOUT0.18(B0) io_H0.13
IO0_B1: io_BA0.17(B1) io_BOUT0.17(B1) io_H0.14
IO0_B2: io_BA0.16(B2) io_BOUT0.16(B2) io_H0.11
IO0_B3: io_BA0.15(B3) io_BOUT0.15(B3) io_H0.12
IO0_B4: io_BA0.14(B4) io_BOUT0.14(B4) io_H0.9
IO0_B5: io_BA0.13(B5) io_BOUT0.13(B5) io_H0.10
IO0_B6: io_BA0.12(B6) io_BOUT0.12(B6) io_H0.7
IO0_B7: io_BA0.11(B7) io_BOUT0.11(B7) io_H0.8
IO0_NOT_OUT: io_BOUT0.19(OE#) op_U4.4(OUT B)
IO1_B0: io_BA1.18(B0) io_BOUT1.18(B0) io_H1.13
IO1_B1: io_BA1.17(B1) io_BOUT1.17(B1) io_H1.14
IO1_B2: io_BA1.16(B2) io_BOUT1.16(B2) io_H1.11
IO1_B3: io_BA1.15(B3) io_BOUT1.15(B3) io_H1.12
IO1_B4: io_BA1.14(B4) io_BOUT1.14(B4) io_H1.9
IO1_B5: io_BA1.13(B5) io_BOUT1.13(B5) io_H1.10
IO1_B6: io_BA1.12(B6) io_BOUT1.12(B6) io_H1.7
IO1_B7: io_BA1.11(B7) io_BOUT1.11(B7) io_H1.8
IO1_NOT_OUT: io_BOUT1.19(OE#) op_U4.10(OUT C)
LD_NOT_EN: ld_BOUT.19(OE#) ld_BOUT2.19(OE#) op_U4.3(OUT A)
MASK0: bw_BOUT1.18(B0) bw_U1.1(Y0#) bw_U3.9(4A)
MASK1: bw_BOUT1.17(B1) bw_U1.2(Y1#) bw_U3.11(5A)
MASK2: bw_BOUT1.16(B2) bw_U1.3(Y2#) bw_U3.3(2A)
MASK3: bw_BOUT1.15(B3) bw_U1.4(Y3#) bw_U3.5(3A)
MASK4: bw_BOUT1.14(B4) bw_U1.5(Y4#) bw_U2.9(4A)
MASK5: bw_BOUT1.13(B5) bw_U1.6(Y5#) bw_U2.11(5A)
MASK6: bw_BOUT1.12(B6) bw_U1.7(Y6#) bw_U2.3(2A)
MASK7: bw_BOUT1.11(B7) bw_U1.8(Y7#) bw_U2.1(1A)
MEMOUT0: H1.2 mu_BOUT.2(A0)
MEMOUT1: H1.4 mu_BOUT.3(A1)
MEMOUT2: H1.6 mu_BOUT.4(A2)
MEMOUT3: H1.8 mu_BOUT.5(A3)
MEMOUT4: H1.10 mu_BOUT.6(A4)
MEMOUT5: H1.12 mu_BOUT.7(A5)
MEMOUT6: H1.14 mu_BOUT.8(A6)
MEMOUT7: H1.16 mu_BOUT.9(A7)
MODE: H3.2 H4.9 R22.1 ; also on sheet 2 16
MODEA: dc_D1.5(D3) H2.24
MODEB: dc_D1.6(D4) H2.26
NMASK0: bw_BOUT2.11(B7) bw_U3.8(4Y)
NMASK1: bw_BOUT2.12(B6) bw_U3.10(5Y)
NMASK2: bw_BOUT2.13(B5) bw_U3.4(2Y)
NMASK3: bw_BOUT2.14(B4) bw_U3.6(3Y)
NMASK4: bw_BOUT2.15(B3) bw_U2.8(4Y)
NMASK5: bw_BOUT2.16(B2) bw_U2.10(5Y)
NMASK6: bw_BOUT2.17(B1) bw_U2.4(2Y)
NMASK7: bw_BOUT2.18(B0) bw_U2.2(1Y)
NOT_BUF_MODEA: dc_BadA.19(OE#) dc_U1.4(2Y)
NOT_BUF_MODEB: dc_BadB.19(OE#) dc_U1.2(1Y)
NOT_CD_RES: dc_D1.8(D6) ; also on sheet 3
NOT_OP4: op_DC1.19(E1#) ; also on sheet 3
NOT_OPCD_00000: dc_U1.13(6A) op_DC0.1(Y0#) op_U4.1(IN 1A)
NOT_OPCD_00001: op_DC0.2(Y1#) op_U4.2(IN 2A)
NOT_OPCD_00010: lg_BOUT1.19(OE#) op_DC0.3(Y2#)
NOT_OPCD_00011: lg_BOUT2.19(OE#) op_DC0.4(Y3#)
NOT_OPCD_00100: lg_BOUT3.19(OE#) op_DC0.5(Y4#)
NOT_OPCD_00101: lg_BOUT4.19(OE#) op_DC0.6(Y5#)
NOT_OPCD_00110: lg_BOUT5.19(OE#) op_DC0.7(Y6#)
NOT_OPCD_00111: lg_BOUT6.19(OE#) op_DC0.8(Y7#)
NOT_OPCD_01000: op_DC0.9(Y8#) ; also on sheet 14
NOT_OPCD_01001: op_DC0.10(Y9#) ; also on sheet 14
NOT_OPCD_01010: op_DC0.11(Y10#) ; also on sheet 14
NOT_OPCD_01011: op_DC0.13(Y11#) ; also on sheet 14
NOT_OPCD_01100: op_DC0.14(Y12#) ; also on sheet 14
NOT_OPCD_01101: op_DC0.15(Y13#) ; also on sheet 14
NOT_OPCD_01110: op_DC0.16(Y14#) ; also on sheet 14
NOT_OPCD_01111: op_DC0.17(Y15#) ; also on sheet 14
NOT_OPCD_10000: bw_BOUT1.19(OE#) op_DC1.1(Y0#)
NOT_OPCD_10001: bw_BOUT2.19(OE#) op_DC1.2(Y1#)
NOT_OPCD_10100: mu_BOUT.19(OE#) op_DC1.5(Y4#)
NOT_OPCD_10101: H2.4 op_DC1.6(Y5#) op_U1.2(IN 2A)
NOT_OPCD_11000: io_H0.4 op_DC1.9(Y8#) op_U4.5(IN 1B)
NOT_OPCD_11001: io_H0.6 op_DC1.10(Y9#) op_U4.6(IN 2B)
NOT_OPCD_11010: io_BA0.19(OE#) io_H0.5 op_DC1.11(Y10#) op_U1.1(IN 1A)
NOT_OPCD_11100: io_H1.4 op_DC1.14(Y12#) op_U4.9(IN 2C)
NOT_OPCD_11101: io_H1.6 op_DC1.15(Y13#) op_U4.8(IN 1C)
NOT_OPCD_11110: io_BA1.19(OE#) io_H1.5 op_DC1.16(Y14#) op_U1.6(IN 2B)
NOT_OPCD_11111: H4.10 op_DC1.17(Y15#) ; also on sheet 3
NOT_PC_MODE_SOURCE_OUT: dc_BadOUT.19(OE#) ; also on sheet 2
OP0: dc_DOP.19(Q0) op_DC0.23(A0) op_DC1.23(A0) ; also on sheet 14
OP1: dc_DOP.18(Q1) op_DC0.22(A1) op_DC1.22(A1) ; also on sheet 14
OP2: dc_DOP.17(Q2) op_DC0.21(A2) op_DC1.21(A2)
OP3: dc_DOP.16(Q3) op_DC0.20(A3) op_DC1.20(A3)
OP4: dc_DOP.15(Q4) op_DC0.19(E1#) ; also on sheet 3
OP_CD0: H1.21 ; also on sheet 3
OP_CD1: H1.23 ; also on sheet 3
OP_CD2: H1.25 ; also on sheet 3
OPCD_00000: dc_BadOUT.5(A3) dc_U1.12(6Y)
OUT0: hd_DOUT.12(Q7) ; also on sheet 1 2
OUT1: hd_DOUT.13(Q6) ; also on sheet 1 2
OUT2: hd_DOUT.14(Q5) ; also on sheet 1 2
OUT3: hd_DOUT.15(Q4) ; also on sheet 1 2
OUT4: hd_DOUT.16(Q3) ; also on sheet 1 2
OUT5: hd_DOUT.17(Q2) ; also on sheet 1 2
OUT6: hd_DOUT.18(Q1) ; also on sheet 1 2
OUT7: hd_DOUT.19(Q0) ; also on sheet 1 2
OUT8: hd_DOUT2.12(Q7) ; also on sheet 2 4
OUT9: hd_DOUT2.13(Q6) ; also on sheet 2 4
OUT10: hd_DOUT2.14(Q5) ; also on sheet 2 4
OUT11: hd_DOUT2.15(Q4) ; also on sheet 2 4
OUT12: hd_DOUT2.16(Q3) ; also on sheet 2 4
OUT13: hd_DOUT2.17(Q2) ; also on sheet 2 4
OUT14: hd_DOUT2.18(Q1) ; also on sheet 2 4
OUT15: hd_DOUT2.19(Q0) ; also on sheet 2 4
PAGE0: H1.5 ; also on sheet 4
PAGE1: H1.7 ; also on sheet 4
PAGE2: H1.9 ; also on sheet 4
PAGE3: H1.11 ; also on sheet 4
PAGE4: H1.13 ; also on sheet 4
PAGE5: H1.15 ; also on sheet 4
PAGE6: H1.17 ; also on sheet 4
PAGE7: H1.19 ; also on sheet 4
PC_B0: H2.42 ; also on sheet 2 16
PC_B1: H2.40 ; also on sheet 2 16
PC_B2: H2.38 ; also on sheet 2 16
PC_B3: H2.36 ; also on sheet 2 16
PC_B4: H2.34 ; also on sheet 2 16
PC_B5: H2.32 ; also on sheet 2 16
PC_B6: H2.30 ; also on sheet 2 16
PC_B7: H2.28 ; also on sheet 2 16
PC_B8: H2.35 ; also on sheet 2 16
PC_B9: H2.33 ; also on sheet 2 16
PC_B10: H2.31 ; also on sheet 2 16
PC_B11: H2.29 ; also on sheet 2 16
PC_B12: H2.27 ; also on sheet 2 16
PC_B13: H2.25 ; also on sheet 2 16
PC_B14: H2.23 ; also on sheet 2 16
PC_B15: H2.21 ; also on sheet 2 16
PC_MODE_SOURCE_OUT: dc_BadPCINC.19(OE#) ; also on sheet 2
PC_SOURCE_INC: H4.8 ; also on sheet 2 16
PRE_RGSET0: dc_BadOUT.2(A0) dc_D1.19(Q0)
PRE_RGSET1: dc_BadOUT.3(A1) dc_D1.18(Q1)
PRE_RGSET2: dc_BadOUT.4(A2) dc_D1.17(Q2)
RES0: bw_BOUT1.2(A0) bw_BOUT2.9(A7) hd_DOUT.9(D7) io_BOUT0.2(A0) io_BOUT1.2(A0) ld_BOUT.18(B0) lg_BOUT1.3(A1) lg_BOUT2.3(A1) lg_BOUT3.3(A1) lg_BOUT4.2(A0) lg_BOUT5.3(A1) lg_BOUT6.3(A1) mu_BOUT.18(B0) ; also on sheet 14
RES1: bw_BOUT1.3(A1) bw_BOUT2.8(A6) hd_DOUT.8(D6) io_BOUT0.3(A1) io_BOUT1.3(A1) ld_BOUT.17(B1) lg_BOUT1.5(A3) lg_BOUT2.5(A3) lg_BOUT3.8(A6) lg_BOUT4.5(A3) lg_BOUT5.8(A6) lg_BOUT6.5(A3) mu_BOUT.17(B1) ; also on sheet 14
RES2: bw_BOUT1.4(A2) bw_BOUT2.7(A5) hd_DOUT.7(D5) io_BOUT0.4(A2) io_BOUT1.4(A2) ld_BOUT.16(B2) lg_BOUT1.7(A5) lg_BOUT2.7(A5) lg_BOUT3.9(A7) lg_BOUT4.8(A6) lg_BOUT5.9(A7) lg_BOUT6.7(A5) mu_BOUT.16(B2) ; also on sheet 14
RES3: bw_BOUT1.5(A3) bw_BOUT2.6(A4) hd_DOUT.6(D4) io_BOUT0.5(A3) io_BOUT1.5(A3) ld_BOUT.15(B3) lg_BOUT1.6(A4) lg_BOUT2.6(A4) lg_BOUT3.5(A3) lg_BOUT4.4(A2) lg_BOUT5.5(A3) lg_BOUT6.6(A4) mu_BOUT.15(B3) ; also on sheet 14
RES4: bw_BOUT1.6(A4) bw_BOUT2.5(A3) hd_DOUT.5(D3) io_BOUT0.6(A4) io_BOUT1.6(A4) ld_BOUT.14(B4) lg_BOUT1.2(A0) lg_BOUT2.2(A0) lg_BOUT3.2(A0) lg_BOUT4.3(A1) lg_BOUT5.2(A0) lg_BOUT6.2(A0) mu_BOUT.14(B4) ; also on sheet 14
RES5: bw_BOUT1.7(A5) bw_BOUT2.4(A2) hd_DOUT.4(D2) io_BOUT0.7(A5) io_BOUT1.7(A5) ld_BOUT.13(B5) lg_BOUT1.4(A2) lg_BOUT2.4(A2) lg_BOUT3.6(A4) lg_BOUT4.7(A5) lg_BOUT5.6(A4) lg_BOUT6.4(A2) mu_BOUT.13(B5) ; also on sheet 14
RES6: bw_BOUT1.8(A6) bw_BOUT2.3(A1) hd_DOUT.3(D1) io_BOUT0.8(A6) io_BOUT1.8(A6) ld_BOUT.12(B6) lg_BOUT1.9(A7) lg_BOUT2.9(A7) lg_BOUT3.7(A5) lg_BOUT4.9(A7) lg_BOUT5.7(A5) lg_BOUT6.9(A7) mu_BOUT.12(B6) ; also on sheet 14
RES7: bw_BOUT1.9(A7) bw_BOUT2.2(A0) hd_DOUT.2(D0) io_BOUT0.9(A7) io_BOUT1.9(A7) ld_BOUT.11(B7) lg_BOUT1.8(A6) lg_BOUT2.8(A6) lg_BOUT3.4(A2) lg_BOUT4.6(A4) lg_BOUT5.4(A2) lg_BOUT6.8(A6) mu_BOUT.11(B7) ; also on sheet 14
RES8: hd_DOUT2.9(D7) ld_BOUT2.2(A0)
RES9: hd_DOUT2.8(D6) ld_BOUT2.3(A1)
RES10: hd_DOUT2.7(D5) ld_BOUT2.4(A2)
RES11: hd_DOUT2.6(D4) ld_BOUT2.5(A3)
RES12: hd_DOUT2.5(D3) ld_BOUT2.6(A4)
RES13: hd_DOUT2.4(D2) ld_BOUT2.7(A5)
RES14: hd_DOUT2.3(D1) ld_BOUT2.8(A6)
RES15: hd_DOUT2.2(D0) ld_BOUT2.9(A7)
STORE: H4.4 op_U1.8(IN 1C) ; also on sheet 16
STORE_WITHOUT_BREAK: op_U1.10(OUT C) ; also on sheet 3
WD_A0: dc_DA.2(D0) H2.19
WD_A1: dc_DA.3(D1) H2.17
WD_A2: dc_DA.4(D2) H2.15
WD_A3: dc_DA.5(D3) H2.13
WD_A4: dc_DA.6(D4) H2.11
WD_A5: dc_DA.7(D5) H2.9
WD_A6: dc_DA.8(D6) H2.7
WD_A7: dc_DA.9(D7) H2.5
WD_B0: dc_DB.2(D0) H2.16
WD_B1: dc_DB.3(D1) H2.14
WD_B2: dc_DB.4(D2) H2.12
WD_B3: dc_DB.5(D3) H2.10
WD_B4: dc_DB.6(D4) H2.8
WD_B5: dc_DB.7(D5) H2.6
WD_B6: dc_DB.8(D6) H2.3
WD_B7: dc_DB.9(D7) H2.1
WD_OP0: dc_BOP.2(A0) H1.18
WD_OP1: dc_BOP.3(A1) H1.20
WD_OP2: dc_BOP.4(A2) H1.22
WD_OP3: dc_BOP.5(A3) H1.24
WD_OP4: dc_BOP.6(A4) H1.26
WD_OUT0: dc_D1.2(D0) H2.18
WD_OUT1: dc_D1.3(D1) H2.20
WD_OUT2: dc_D1.4(D2) H2.22
$7N2655: dc_BA.2(A0) dc_BadA.2(A0) dc_DA.19(Q0)
$7N2659: dc_BA.9(A7) dc_BadA.9(A7) dc_DA.12(Q7)
$7N2661: dc_BA.8(A6) dc_BadA.8(A6) dc_DA.13(Q6)
$7N2663: dc_BA.7(A5) dc_BadA.7(A5) dc_DA.14(Q5)
$7N2665: dc_BA.6(A4) dc_BadA.6(A4) dc_DA.15(Q4)
$7N2667: dc_BA.5(A3) dc_BadA.5(A3) dc_DA.16(Q3)
$7N2669: dc_BA.4(A2) dc_BadA.4(A2) dc_DA.17(Q2)
$7N2671: dc_BA.3(A1) dc_BadA.3(A1) dc_DA.18(Q1)
$7N3215: dc_BadB.2(A0) dc_BB.2(A0) dc_DB.19(Q0)
$7N3216: dc_BadB.6(A4) dc_BB.6(A4) dc_DB.15(Q4)
$7N3217: dc_BadB.5(A3) dc_BB.5(A3) dc_DB.16(Q3)
$7N3218: dc_BadB.4(A2) dc_BB.4(A2) dc_DB.17(Q2)
$7N3219: dc_BadB.3(A1) dc_BB.3(A1) dc_DB.18(Q1)
$7N3220: dc_BadB.9(A7) dc_BB.9(A7) dc_DB.12(Q7)
$7N3221: dc_BadB.8(A6) dc_BB.8(A6) dc_DB.13(Q6)
$7N3222: dc_BadB.7(A5) dc_BB.7(A5) dc_DB.14(Q5)
$7N4273: dc_BOP.14(B4) dc_DOP.6(D4) R17.2
$7N4281: dc_BOP.16(B2) dc_DOP.4(D2) R19.2
$7N4283: dc_BOP.15(B3) dc_DOP.5(D3) R18.2
$7N4294: dc_BOP.17(B1) dc_DOP.3(D1) R20.2
$7N4297: dc_BOP.18(B0) dc_DOP.2(D0) R21.2
$11N1150: op_U1.3(OUT A) op_U1.5(IN 1B)
$11N1158: op_U1.4(OUT B) op_U1.13(IN 2D)
$11N1184: op_U1.9(IN 2C) op_U1.11(OUT D)

Not connected (* = marked no-connect by the designer): bw_U1 9(Y8#)* 10(Y9#)* 11(Y10#)* 13(Y11#)* 14(Y12#)* 15(Y13#)* 16(Y14#)* 17(Y15#)*; bw_U2 5(3A)* 6(3Y)* 12(6Y)* 13(6A)*; bw_U3 1(1A)* 2(1Y)* 12(6Y)* 13(6A)*; dc_BadA 11(B7)* 12(B6)* 13(B5)* 14(B4)*; dc_BadB 11(B7)* 12(B6)* 13(B5)* 14(B4)*; dc_BadOUT 6(A4)* 7(A5)* 8(A6)* 9(A7)* 11(B7)* 12(B6)* 13(B5)* 14(B4)*; dc_BadPCINC 6(A4)* 7(A5)* 8(A6)* 9(A7)* 11(B7)* 12(B6)* 13(B5)* 14(B4)*; dc_BOP 7(A5)* 8(A6)* 9(A7)* 11(B7)* 12(B6)* 13(B5)*; dc_D1 9(D7)* 12(Q7)*; dc_DOP 7(D5)* 8(D6)* 9(D7)* 12(Q7)* 13(Q6)* 14(Q5)*; dc_U1 5(3A)* 6(3Y)* 8(4Y)* 9(4A)* 10(5Y)* 11(5A)*; op_DC1 3(Y2#)* 4(Y3#)* 7(Y6#)* 8(Y7#)* 13(Y11#)*; op_U4 11(OUT D)* 12(IN 1D)* 13(IN 2D)*
